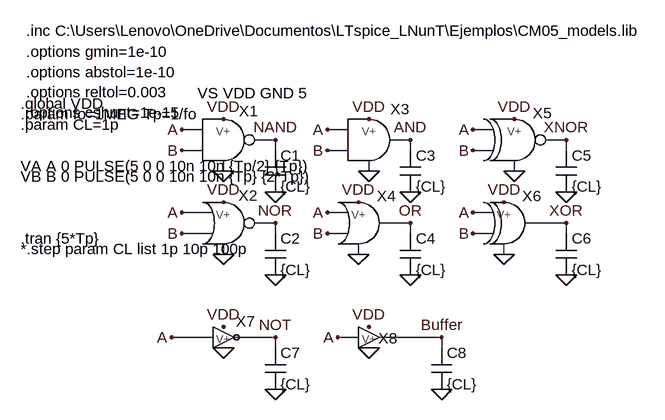
[diagram p0: schematic GATE2X1_sim.asc]
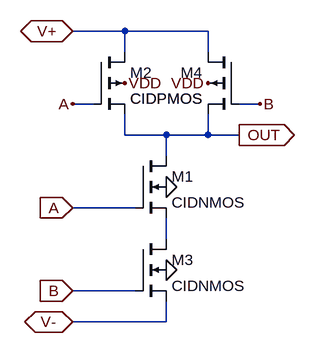
[diagram p1: sub-circuit nand2x1.asc]
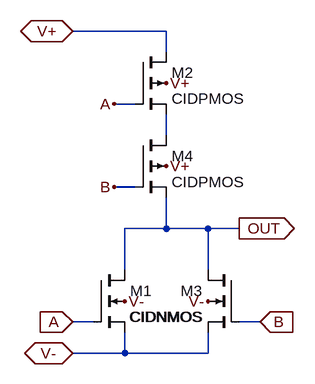
[diagram p2: sub-circuit nor2x1.asc]
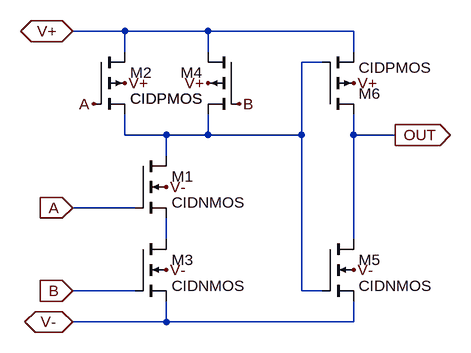
[diagram p3: sub-circuit and2x1.asc]
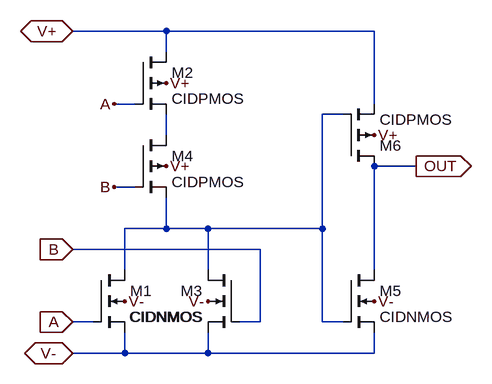
[diagram p4: sub-circuit or2x1.asc]
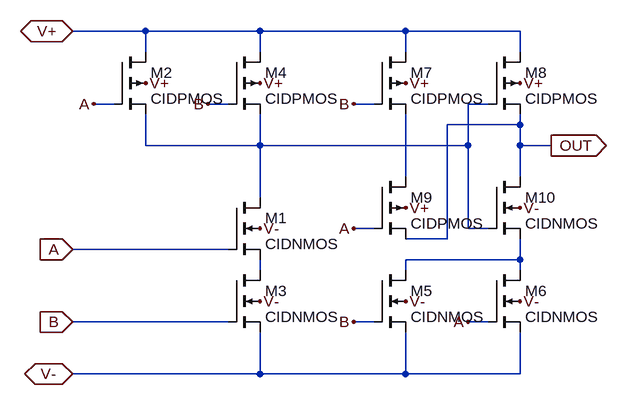
[diagram p5: sub-circuit xnor2x1.asc]
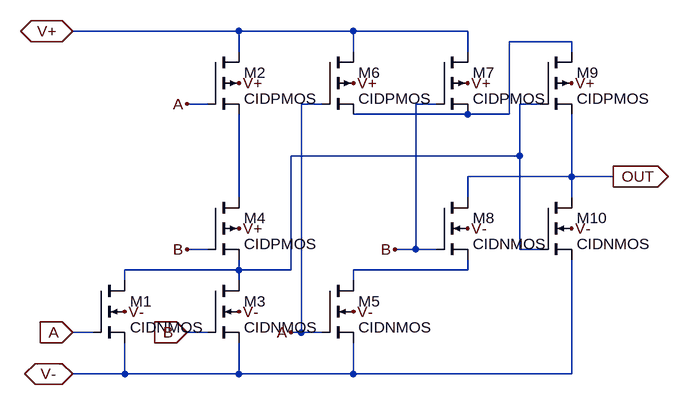
[diagram p6: sub-circuit xor2x1.asc]
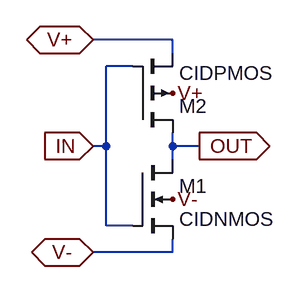
[diagram p7: sub-circuit not.asc]
GATE2X1_sim.asc, the LTspice schematic file:
Version 4.1
SHEET 1 880 680
WIRE 128 128 96 128
WIRE 352 128 320 128
WIRE 576 128 544 128
WIRE 240 144 208 144
WIRE 448 144 416 144
WIRE 688 144 656 144
WIRE 128 160 96 160
WIRE 240 160 240 144
WIRE 352 160 320 160
WIRE 448 160 448 144
WIRE 576 160 544 160
WIRE 688 160 688 144
WIRE 160 192 160 176
WIRE 384 192 384 176
WIRE 608 192 608 176
WIRE 144 256 96 256
WIRE 352 256 320 256
WIRE 576 256 544 256
WIRE 240 272 208 272
WIRE 448 272 400 272
WIRE 688 272 624 272
WIRE 144 288 96 288
WIRE 240 288 240 272
WIRE 352 288 320 288
WIRE 448 288 448 272
WIRE 576 288 544 288
WIRE 688 288 688 272
WIRE 160 320 160 304
WIRE 368 320 368 304
WIRE 592 320 592 304
WIRE 144 448 80 448
WIRE 240 448 176 448
WIRE 368 448 336 448
WIRE 496 448 400 448
WIRE 240 464 240 448
WIRE 496 464 496 448
FLAG 96 128 A
FLAG 96 160 B
FLAG 240 224 0
FLAG 240 144 NAND
FLAG 96 256 A
FLAG 96 288 B
FLAG 240 352 0
FLAG 240 272 NOR
FLAG 320 128 A
FLAG 320 160 B
FLAG 448 224 0
FLAG 448 144 AND
FLAG 320 256 A
FLAG 320 288 B
FLAG 448 352 0
FLAG 448 272 OR
FLAG 544 128 A
FLAG 544 160 B
FLAG 688 224 0
FLAG 688 144 XNOR
FLAG 544 256 A
FLAG 544 288 B
FLAG 688 352 0
FLAG 688 272 XOR
FLAG 80 448 A
FLAG 240 528 0
FLAG 240 448 NOT
FLAG 336 448 A
FLAG 496 528 0
FLAG 496 448 Buffer
FLAG 160 112 VDD
FLAG 384 112 VDD
FLAG 608 112 VDD
FLAG 160 240 VDD
FLAG 368 240 VDD
FLAG 592 240 VDD
FLAG 160 432 VDD
FLAG 384 432 VDD
FLAG 160 192 0
FLAG 384 192 0
FLAG 608 192 0
FLAG 592 320 0
FLAG 368 320 0
FLAG 160 320 0
FLAG 160 464 0
FLAG 384 464 0
SYMBOL NAND2X1 160 144 R0
SYMATTR InstName X1
SYMBOL cap 224 160 R0
SYMATTR InstName C1
SYMATTR Value {CL}
SYMBOL NOR2X1 160 272 R0
SYMATTR InstName X2
SYMBOL cap 224 288 R0
SYMATTR InstName C2
SYMATTR Value {CL}
SYMBOL cap 432 160 R0
SYMATTR InstName C3
SYMATTR Value {CL}
SYMBOL AND2X1 384 144 R0
SYMATTR InstName X3
SYMBOL cap 432 288 R0
SYMATTR InstName C4
SYMATTR Value {CL}
SYMBOL OR2X1 368 272 R0
SYMATTR InstName X4
SYMBOL cap 672 160 R0
SYMATTR InstName C5
SYMATTR Value {CL}
SYMBOL XNOR2x1 608 144 R0
SYMATTR InstName X5
SYMBOL cap 672 288 R0
SYMATTR InstName C6
SYMATTR Value {CL}
SYMBOL XOR2X1 592 272 R0
SYMATTR InstName X6
SYMBOL cap 224 464 R0
SYMATTR InstName C7
SYMATTR Value {CL}
SYMBOL NOT 144 448 R0
SYMATTR InstName X7
SYMBOL cap 480 464 R0
SYMATTR InstName C8
SYMATTR Value {CL}
SYMBOL Buffer 384 448 R0
SYMATTR InstName X8
TEXT -144 -24 Left 2 !.inc C:\\Users\\Lenovo\\OneDrive\\Documentos\\LTspice_LNunT\\Ejemplos\\CM05_models.lib
TEXT -152 184 Left 2 !VA A 0 PULSE(5 0 0 10n 10n {Tp/2} {Tp})
TEXT -152 200 Left 2 !VB B 0 PULSE(5 0 0 10n 10n {Tp} {2*Tp})
TEXT 120 72 Left 2 !VS VDD GND 5
TEXT -152 296 Left 2 !.tran {5*Tp}
TEXT -152 88 Left 2 !.global VDD
TEXT -152 120 Left 2 !.param CL=1p
TEXT -152 312 Left 2 !*.step param CL list 1p 10p 100p
TEXT -152 104 Left 2 !.param fo=1MEG Tp=1/fo
TEXT -144 8 Left 2 !.options gmin=1e-10\n.options abstol=1e-10\n.options reltol=0.003\n.options cshunt=1e-15

nand2x1.asc, the sub-circuit schematic file:
Version 4.1
SHEET 1 880 680
WIRE 16 -80 -64 -80
WIRE 144 -80 16 -80
WIRE 16 -48 16 -80
WIRE 144 -48 144 -80
WIRE -32 32 -64 32
WIRE 224 32 192 32
WIRE 16 80 16 48
WIRE 80 80 16 80
WIRE 144 80 144 48
WIRE 144 80 80 80
WIRE 192 80 144 80
WIRE 80 112 80 80
WIRE 32 192 -64 192
WIRE 80 240 80 208
WIRE 32 320 -64 320
WIRE 80 368 80 336
WIRE 80 368 -64 368
FLAG -64 192 A
IOPIN -64 192 In
FLAG -64 320 B
IOPIN -64 320 In
FLAG 192 80 OUT
IOPIN 192 80 Out
FLAG -64 32 A
FLAG 224 32 B
FLAG -64 368 V-
IOPIN -64 368 BiDir
FLAG -64 -80 V+
IOPIN -64 -80 BiDir
FLAG 80 288 0
FLAG 80 160 0
FLAG 16 0 VDD
FLAG 144 0 VDD
SYMBOL nmos4 32 112 R0
SYMATTR InstName M1
SYMATTR Value CIDNMOS
SYMATTR Value2 l=5u w=10u
SYMBOL pmos4 -32 -48 R0
SYMATTR InstName M2
SYMATTR Value CIDPMOS
SYMATTR Value2 l=5u w=25u
SYMBOL nmos4 32 240 R0
SYMATTR InstName M3
SYMATTR Value CIDNMOS
SYMATTR Value2 l=5u w=10u
SYMBOL pmos4 192 -48 M0
SYMATTR InstName M4
SYMATTR Value CIDPMOS
SYMATTR Value2 l=5u w=25u

nor2x1.asc, the sub-circuit schematic file:
Version 4.1
SHEET 1 880 680
WIRE 192 -160 48 -160
WIRE 192 -128 192 -160
WIRE 144 -48 112 -48
WIRE 192 0 192 -32
WIRE 144 80 112 80
WIRE 192 144 192 96
WIRE 192 144 128 144
WIRE 256 144 192 144
WIRE 304 144 256 144
WIRE 128 208 128 144
WIRE 256 208 256 144
WIRE 80 288 48 288
WIRE 336 288 304 288
WIRE 128 336 128 304
WIRE 128 336 48 336
WIRE 256 336 256 304
WIRE 256 336 128 336
FLAG 48 288 A
IOPIN 48 288 In
FLAG 336 288 B
IOPIN 336 288 In
FLAG 304 144 OUT
IOPIN 304 144 Out
FLAG 112 -48 A
FLAG 112 80 B
FLAG 48 -160 V+
IOPIN 48 -160 BiDir
FLAG 256 256 V-
FLAG 128 256 V-
FLAG 192 -80 V+
FLAG 192 48 V+
FLAG 48 336 V-
IOPIN 48 336 BiDir
SYMBOL nmos4 80 208 R0
SYMATTR InstName M1
SYMATTR Value CIDNMOS
SYMATTR Value2 l=5u w=10u
SYMBOL pmos4 144 -128 R0
SYMATTR InstName M2
SYMATTR Value CIDPMOS
SYMATTR Value2 l=5u w=25u
SYMBOL nmos4 304 208 M0
SYMATTR InstName M3
SYMATTR Value CIDNMOS
SYMATTR Value2 l=5u w=10u
SYMBOL pmos4 144 0 R0
SYMATTR InstName M4
SYMATTR Value CIDPMOS
SYMATTR Value2 l=5u w=25u

and2x1.asc, the sub-circuit schematic file:
Version 4.1
SHEET 1 880 680
WIRE 144 -112 64 -112
WIRE 272 -112 144 -112
WIRE 496 -112 272 -112
WIRE 144 -80 144 -112
WIRE 272 -80 272 -112
WIRE 496 -80 496 -112
WIRE 448 -64 416 -64
WIRE 144 48 144 16
WIRE 208 48 144 48
WIRE 272 48 272 16
WIRE 272 48 208 48
WIRE 416 48 416 -64
WIRE 416 48 272 48
WIRE 496 48 496 16
WIRE 560 48 496 48
WIRE 208 80 208 48
WIRE 160 160 64 160
WIRE 208 208 208 176
WIRE 496 208 496 48
WIRE 160 288 64 288
WIRE 416 288 416 48
WIRE 448 288 416 288
WIRE 208 336 208 304
WIRE 208 336 64 336
WIRE 496 336 496 304
WIRE 496 336 208 336
FLAG 64 160 A
IOPIN 64 160 In
FLAG 64 288 B
IOPIN 64 288 In
FLAG 560 48 OUT
IOPIN 560 48 Out
FLAG 96 0 A
FLAG 320 0 B
FLAG 64 336 V-
IOPIN 64 336 BiDir
FLAG 64 -112 V+
IOPIN 64 -112 BiDir
FLAG 208 256 V-
FLAG 208 128 V-
FLAG 144 -32 V+
FLAG 272 -32 V+
FLAG 496 -32 V+
FLAG 496 256 V-
SYMBOL nmos4 160 80 R0
SYMATTR InstName M1
SYMATTR Value CIDNMOS
SYMATTR Value2 l=5u w=10u
SYMBOL pmos4 96 -80 R0
SYMATTR InstName M2
SYMATTR Value CIDPMOS
SYMATTR Value2 l=5u w=25u
SYMBOL nmos4 160 208 R0
SYMATTR InstName M3
SYMATTR Value CIDNMOS
SYMATTR Value2 l=5u w=10u
SYMBOL pmos4 320 -80 M0
SYMATTR InstName M4
SYMATTR Value CIDPMOS
SYMATTR Value2 l=5u w=25u
SYMBOL nmos4 448 208 R0
SYMATTR InstName M5
SYMATTR Value CIDNMOS
SYMATTR Value2 l=5u w=10u
SYMBOL pmos4 448 16 M180
SYMATTR InstName M6
SYMATTR Value CIDPMOS
SYMATTR Value2 l=5u w=25u

or2x1.asc, the sub-circuit schematic file:
Version 4.1
SHEET 1 880 680
WIRE 208 -160 64 -160
WIRE 528 -160 208 -160
WIRE 208 -128 208 -160
WIRE 160 -48 128 -48
WIRE 528 -48 528 -160
WIRE 480 -32 448 -32
WIRE 208 0 208 -32
WIRE 592 48 528 48
WIRE 160 80 128 80
WIRE 208 144 208 96
WIRE 208 144 144 144
WIRE 272 144 208 144
WIRE 448 144 448 -32
WIRE 448 144 272 144
WIRE 352 176 64 176
WIRE 144 208 144 144
WIRE 272 208 272 144
WIRE 528 208 528 48
WIRE 96 288 64 288
WIRE 352 288 352 176
WIRE 352 288 320 288
WIRE 448 288 448 144
WIRE 480 288 448 288
WIRE 144 336 144 304
WIRE 144 336 64 336
WIRE 272 336 272 304
WIRE 272 336 144 336
WIRE 528 336 528 304
WIRE 528 336 272 336
FLAG 64 288 A
IOPIN 64 288 In
FLAG 64 176 B
IOPIN 64 176 In
FLAG 128 -48 A
FLAG 128 80 B
FLAG 64 -160 V+
IOPIN 64 -160 BiDir
FLAG 272 256 V-
FLAG 144 256 V-
FLAG 208 -80 V+
FLAG 208 48 V+
FLAG 64 336 V-
IOPIN 64 336 BiDir
FLAG 592 48 OUT
IOPIN 592 48 Out
FLAG 528 0 V+
FLAG 528 256 V-
SYMBOL nmos4 96 208 R0
SYMATTR InstName M1
SYMATTR Value CIDNMOS
SYMATTR Value2 l=5u w=10u
SYMBOL pmos4 160 -128 R0
SYMATTR InstName M2
SYMATTR Value CIDPMOS
SYMATTR Value2 l=5u w=25u
SYMBOL nmos4 320 208 M0
SYMATTR InstName M3
SYMATTR Value CIDNMOS
SYMATTR Value2 l=5u w=10u
SYMBOL pmos4 160 0 R0
SYMATTR InstName M4
SYMATTR Value CIDPMOS
SYMATTR Value2 l=5u w=25u
SYMBOL nmos4 480 208 R0
SYMATTR InstName M5
SYMATTR Value CIDNMOS
SYMATTR Value2 l=5u w=10u
SYMBOL pmos4 480 48 M180
SYMATTR InstName M6
SYMATTR Value CIDPMOS
SYMATTR Value2 l=5u w=25u

xnor2x1.asc, the sub-circuit schematic file:
Version 4.1
SHEET 1 880 680
WIRE 16 -64 -96 -64
WIRE 192 -64 16 -64
WIRE 416 -64 192 -64
WIRE 592 -64 416 -64
WIRE 16 -32 16 -64
WIRE 192 -32 192 -64
WIRE 416 -32 416 -64
WIRE 592 -32 592 -64
WIRE -32 48 -64 48
WIRE 144 48 112 48
WIRE 368 48 336 48
WIRE 544 48 512 48
WIRE 592 80 592 64
WIRE 592 80 480 80
WIRE 16 112 16 64
WIRE 192 112 192 64
WIRE 192 112 16 112
WIRE 512 112 512 48
WIRE 512 112 192 112
WIRE 592 112 592 80
WIRE 640 112 592 112
WIRE 416 160 416 64
WIRE 592 160 592 112
WIRE 192 192 192 112
WIRE 368 240 336 240
WIRE 512 240 512 112
WIRE 544 240 512 240
WIRE 480 256 480 80
WIRE 480 256 416 256
WIRE 144 272 -96 272
WIRE 592 288 592 256
WIRE 592 288 416 288
WIRE 192 304 192 288
WIRE 416 304 416 288
WIRE 592 304 592 288
WIRE 144 384 -96 384
WIRE 368 384 336 384
WIRE 544 384 512 384
WIRE 192 464 192 400
WIRE 192 464 -96 464
WIRE 416 464 416 400
WIRE 416 464 192 464
WIRE 592 464 592 400
WIRE 592 464 416 464
FLAG -96 272 A
IOPIN -96 272 In
FLAG -64 48 A
FLAG -96 -64 V+
IOPIN -96 -64 BiDir
FLAG -96 464 V-
IOPIN -96 464 BiDir
FLAG 192 352 V-
FLAG -96 384 B
IOPIN -96 384 In
FLAG 112 48 B
FLAG 192 16 V+
FLAG 16 16 V+
FLAG 416 16 V+
FLAG 592 16 V+
FLAG 416 208 V+
FLAG 336 48 B
FLAG 336 384 B
FLAG 336 240 A
FLAG 512 384 A
FLAG 640 112 OUT
IOPIN 640 112 Out
FLAG 416 352 V-
FLAG 592 352 V-
FLAG 592 208 V-
FLAG 192 240 V-
SYMBOL nmos4 144 192 R0
SYMATTR InstName M1
SYMATTR Value CIDNMOS
SYMATTR Value2 l=5u w=10u
SYMBOL pmos4 -32 -32 R0
SYMATTR InstName M2
SYMATTR Value CIDPMOS
SYMATTR Value2 l=5u w=25u
SYMBOL nmos4 144 304 R0
SYMATTR InstName M3
SYMATTR Value CIDNMOS
SYMATTR Value2 l=5u w=10u
SYMBOL pmos4 144 -32 R0
SYMATTR InstName M4
SYMATTR Value CIDPMOS
SYMATTR Value2 l=5u w=25u
SYMBOL nmos4 368 304 R0
SYMATTR InstName M5
SYMATTR Value CIDNMOS
SYMATTR Value2 l=5u w=10u
SYMBOL nmos4 544 304 R0
SYMATTR InstName M6
SYMATTR Value CIDNMOS
SYMATTR Value2 l=5u w=10u
SYMBOL pmos4 368 -32 R0
SYMATTR InstName M7
SYMATTR Value CIDPMOS
SYMATTR Value2 l=5u w=25u
SYMBOL pmos4 544 -32 R0
SYMATTR InstName M8
SYMATTR Value CIDPMOS
SYMATTR Value2 l=5u w=25u
SYMBOL pmos4 368 160 R0
SYMATTR InstName M9
SYMATTR Value CIDPMOS
SYMATTR Value2 l=5u w=25u
SYMBOL nmos4 544 160 R0
SYMATTR InstName M10
SYMATTR Value CIDNMOS
SYMATTR Value2 l=5u w=10u

xor2x1.asc, the sub-circuit schematic file:
Version 4.1
SHEET 1 880 680
WIRE 256 -192 0 -192
WIRE 432 -192 256 -192
WIRE 608 -192 432 -192
WIRE 768 -176 672 -176
WIRE 256 -160 256 -192
WIRE 432 -160 432 -192
WIRE 608 -160 608 -192
WIRE 768 -160 768 -176
WIRE 208 -80 176 -80
WIRE 384 -80 352 -80
WIRE 560 -80 528 -80
WIRE 720 -80 688 -80
WIRE 608 -64 432 -64
WIRE 672 -64 672 -176
WIRE 672 -64 608 -64
WIRE 688 0 688 -80
WIRE 688 0 336 0
WIRE 768 32 768 -64
WIRE 768 32 608 32
WIRE 832 32 768 32
WIRE 256 64 256 -64
WIRE 608 64 608 32
WIRE 768 64 768 32
WIRE 208 144 176 144
WIRE 528 144 528 -80
WIRE 528 144 496 144
WIRE 560 144 528 144
WIRE 688 144 688 0
WIRE 720 144 688 144
WIRE 256 176 256 160
WIRE 256 176 80 176
WIRE 336 176 336 0
WIRE 336 176 256 176
WIRE 608 176 608 160
WIRE 608 176 432 176
WIRE 80 192 80 176
WIRE 256 192 256 176
WIRE 432 192 432 176
WIRE 32 272 0 272
WIRE 208 272 176 272
WIRE 352 272 352 -80
WIRE 352 272 336 272
WIRE 384 272 352 272
WIRE 80 336 80 288
WIRE 80 336 0 336
WIRE 256 336 256 288
WIRE 256 336 80 336
WIRE 432 336 432 288
WIRE 432 336 256 336
WIRE 768 336 768 160
WIRE 768 336 432 336
FLAG 0 272 A
IOPIN 0 272 In
FLAG 176 -80 A
FLAG 0 -192 V+
IOPIN 0 -192 BiDir
FLAG 256 240 V-
FLAG 80 240 V-
FLAG 176 272 B
IOPIN 176 272 In
FLAG 176 144 B
FLAG 256 112 V+
FLAG 256 -112 V+
FLAG 0 336 V-
IOPIN 0 336 BiDir
FLAG 336 272 A
FLAG 432 240 V-
FLAG 608 112 V-
FLAG 432 -112 V+
FLAG 608 -112 V+
FLAG 496 144 B
FLAG 768 -112 V+
FLAG 768 112 V-
FLAG 832 32 OUT
IOPIN 832 32 Out
SYMBOL nmos4 32 192 R0
SYMATTR InstName M1
SYMATTR Value CIDNMOS
SYMATTR Value2 l=5u w=10u
SYMBOL pmos4 208 -160 R0
SYMATTR InstName M2
SYMATTR Value CIDPMOS
SYMATTR Value2 l=5u w=25u
SYMBOL nmos4 208 192 R0
SYMATTR InstName M3
SYMATTR Value CIDNMOS
SYMATTR Value2 l=5u w=10u
SYMBOL pmos4 208 64 R0
SYMATTR InstName M4
SYMATTR Value CIDPMOS
SYMATTR Value2 l=5u w=25u
SYMBOL nmos4 384 192 R0
SYMATTR InstName M5
SYMATTR Value CIDNMOS
SYMATTR Value2 l=5u w=10u
SYMBOL pmos4 384 -160 R0
SYMATTR InstName M6
SYMATTR Value CIDPMOS
SYMATTR Value2 l=5u w=25u
SYMBOL pmos4 560 -160 R0
SYMATTR InstName M7
SYMATTR Value CIDPMOS
SYMATTR Value2 l=5u w=25u
SYMBOL nmos4 560 64 R0
SYMATTR InstName M8
SYMATTR Value CIDNMOS
SYMATTR Value2 l=5u w=10u
SYMBOL pmos4 720 -160 R0
SYMATTR InstName M9
SYMATTR Value CIDPMOS
SYMATTR Value2 l=5u w=25u
SYMBOL nmos4 720 64 R0
SYMATTR InstName M10
SYMATTR Value CIDNMOS
SYMATTR Value2 l=5u w=10u

not.asc, the sub-circuit schematic file:
Version 4.1
SHEET 1 880 680
WIRE 256 16 160 16
WIRE 256 32 256 16
WIRE 208 48 176 48
WIRE 176 144 176 48
WIRE 176 144 160 144
WIRE 256 144 256 128
WIRE 288 144 256 144
WIRE 256 160 256 144
WIRE 176 240 176 144
WIRE 208 240 176 240
WIRE 256 272 256 256
WIRE 256 272 160 272
FLAG 160 144 IN
IOPIN 160 144 In
FLAG 288 144 OUT
IOPIN 288 144 Out
FLAG 160 272 V-
IOPIN 160 272 BiDir
FLAG 256 208 V-
FLAG 160 16 V+
IOPIN 160 16 BiDir
FLAG 256 80 V+
SYMBOL nmos4 208 160 R0
SYMATTR InstName M1
SYMATTR Value CIDNMOS
SYMATTR Value2 l=5u w=10u
SYMBOL pmos4 208 128 M180
SYMATTR InstName M2
SYMATTR Value CIDPMOS
SYMATTR Value2 l=5u w=25u

buffer.asc, the sub-circuit schematic file:
Version 4.1
SHEET 1 880 680
WIRE 256 32 160 32
WIRE 384 32 256 32
WIRE 208 48 176 48
WIRE 336 48 320 48
WIRE 176 144 176 48
WIRE 176 144 160 144
WIRE 256 144 256 128
WIRE 320 144 320 48
WIRE 320 144 256 144
WIRE 384 144 384 128
WIRE 416 144 384 144
WIRE 256 160 256 144
WIRE 384 160 384 144
WIRE 176 240 176 144
WIRE 208 240 176 240
WIRE 320 240 320 144
WIRE 336 240 320 240
WIRE 256 256 160 256
WIRE 384 256 256 256
FLAG 160 144 IN
IOPIN 160 144 In
FLAG 416 144 OUT
IOPIN 416 144 Out
FLAG 160 256 V-
IOPIN 160 256 BiDir
FLAG 256 208 V-
FLAG 160 32 V+
IOPIN 160 32 BiDir
FLAG 256 80 V+
FLAG 384 208 V-
FLAG 384 80 V+
SYMBOL nmos4 208 160 R0
SYMATTR InstName M1
SYMATTR Value CIDNMOS
SYMATTR Value2 l=5u w=10u
SYMBOL pmos4 208 128 M180
SYMATTR InstName M2
SYMATTR Value CIDPMOS
SYMATTR Value2 l=5u w=25u
SYMBOL nmos4 336 160 R0
SYMATTR InstName M3
SYMATTR Value CIDNMOS
SYMATTR Value2 l=5u w=10u
SYMBOL pmos4 336 128 M180
SYMATTR InstName M4
SYMATTR Value CIDPMOS
SYMATTR Value2 l=5u w=25u

The netlist it stands for:
* GATE2X1_sim.asc
X§X1 A B NAND VDD 0 nand2x1
C1 NAND 0 {CL}
X§X2 A B NOR VDD 0 nor2x1
C2 NOR 0 {CL}
C3 AND 0 {CL}
X§X3 A B AND VDD 0 and2x1
C4 OR 0 {CL}
X§X4 A B OR VDD 0 or2x1
C5 XNOR 0 {CL}
X§X5 A B XNOR VDD 0 xnor2x1
C6 XOR 0 {CL}
X§X6 A B XOR VDD 0 xor2x1
C7 NOT 0 {CL}
X§X7 A NOT VDD 0 not
C8 Buffer 0 {CL}
X§X8 A Buffer VDD 0 buffer

* block symbol definitions
.subckt nand2x1 A B OUT V+ V-
M1 OUT A N001 0 CIDNMOS l=5u w=10u
M2 V+ A OUT VDD CIDPMOS l=5u w=25u
M3 N001 B V- 0 CIDNMOS l=5u w=10u
M4 V+ B OUT VDD CIDPMOS l=5u w=25u
.ends nand2x1

.subckt nor2x1 A B OUT V+ V-
M1 OUT A V- V- CIDNMOS l=5u w=10u
M2 V+ A N001 V+ CIDPMOS l=5u w=25u
M3 OUT B V- V- CIDNMOS l=5u w=10u
M4 N001 B OUT V+ CIDPMOS l=5u w=25u
.ends nor2x1

.subckt and2x1 A B OUT V+ V-
M1 N001 A N002 V- CIDNMOS l=5u w=10u
M2 V+ A N001 V+ CIDPMOS l=5u w=25u
M3 N002 B V- V- CIDNMOS l=5u w=10u
M4 V+ B N001 V+ CIDPMOS l=5u w=25u
M5 OUT N001 V- V- CIDNMOS l=5u w=10u
M6 OUT N001 V+ V+ CIDPMOS l=5u w=25u
.ends and2x1

.subckt or2x1 A B OUT V+ V-
M1 N001 A V- V- CIDNMOS l=5u w=10u
M2 V+ A N002 V+ CIDPMOS l=5u w=25u
M3 N001 B V- V- CIDNMOS l=5u w=10u
M4 N002 B N001 V+ CIDPMOS l=5u w=25u
M5 OUT N001 V- V- CIDNMOS l=5u w=10u
M6 OUT N001 V+ V+ CIDPMOS l=5u w=25u
.ends or2x1

.subckt xnor2x1 A B OUT V+ V-
M1 N001 A N004 V- CIDNMOS l=5u w=10u
M2 V+ A N001 V+ CIDPMOS l=5u w=25u
M3 N004 B V- V- CIDNMOS l=5u w=10u
M4 V+ B N001 V+ CIDPMOS l=5u w=25u
M5 N003 B V- V- CIDNMOS l=5u w=10u
M6 N003 A V- V- CIDNMOS l=5u w=10u
M7 V+ B N002 V+ CIDPMOS l=5u w=25u
M8 V+ N001 OUT V+ CIDPMOS l=5u w=25u
M9 N002 A OUT V+ CIDPMOS l=5u w=25u
M10 OUT N001 N003 V- CIDNMOS l=5u w=10u
.ends xnor2x1

.subckt xor2x1 A B OUT V+ V-
M1 N002 A V- V- CIDNMOS l=5u w=10u
M2 V+ A N003 V+ CIDPMOS l=5u w=25u
M3 N002 B V- V- CIDNMOS l=5u w=10u
M4 N003 B N002 V+ CIDPMOS l=5u w=25u
M5 N004 A V- V- CIDNMOS l=5u w=10u
M6 V+ A N001 V+ CIDPMOS l=5u w=25u
M7 V+ B N001 V+ CIDPMOS l=5u w=25u
M8 OUT B N004 V- CIDNMOS l=5u w=10u
M9 N001 N002 OUT V+ CIDPMOS l=5u w=25u
M10 OUT N002 V- V- CIDNMOS l=5u w=10u
.ends xor2x1

.subckt not IN OUT V+ V-
M1 OUT IN V- V- CIDNMOS l=5u w=10u
M2 OUT IN V+ V+ CIDPMOS l=5u w=25u
.ends not

.subckt buffer IN OUT V+ V-
M1 N001 IN V- V- CIDNMOS l=5u w=10u
M2 N001 IN V+ V+ CIDPMOS l=5u w=25u
M3 OUT N001 V- V- CIDNMOS l=5u w=10u
M4 OUT N001 V+ V+ CIDPMOS l=5u w=25u
.ends buffer

.model NMOS NMOS
.model PMOS PMOS
.lib standard.mos
.inc C:\Users\Lenovo\OneDrive\Documentos\LTspice_LNunT\Ejemplos\CM05_models.lib
VA A 0 PULSE(5 0 0 10n 10n {Tp/2} {Tp})
VB B 0 PULSE(5 0 0 10n 10n {Tp} {2*Tp})
VS VDD GND 5
.tran {5*Tp}
.global VDD
.param CL=1p
*.step param CL list 1p 10p 100p
.param fo=1MEG Tp=1/fo
.options gmin=1e-10
.options abstol=1e-10
.options reltol=0.003
.options cshunt=1e-15
.backanno
.end